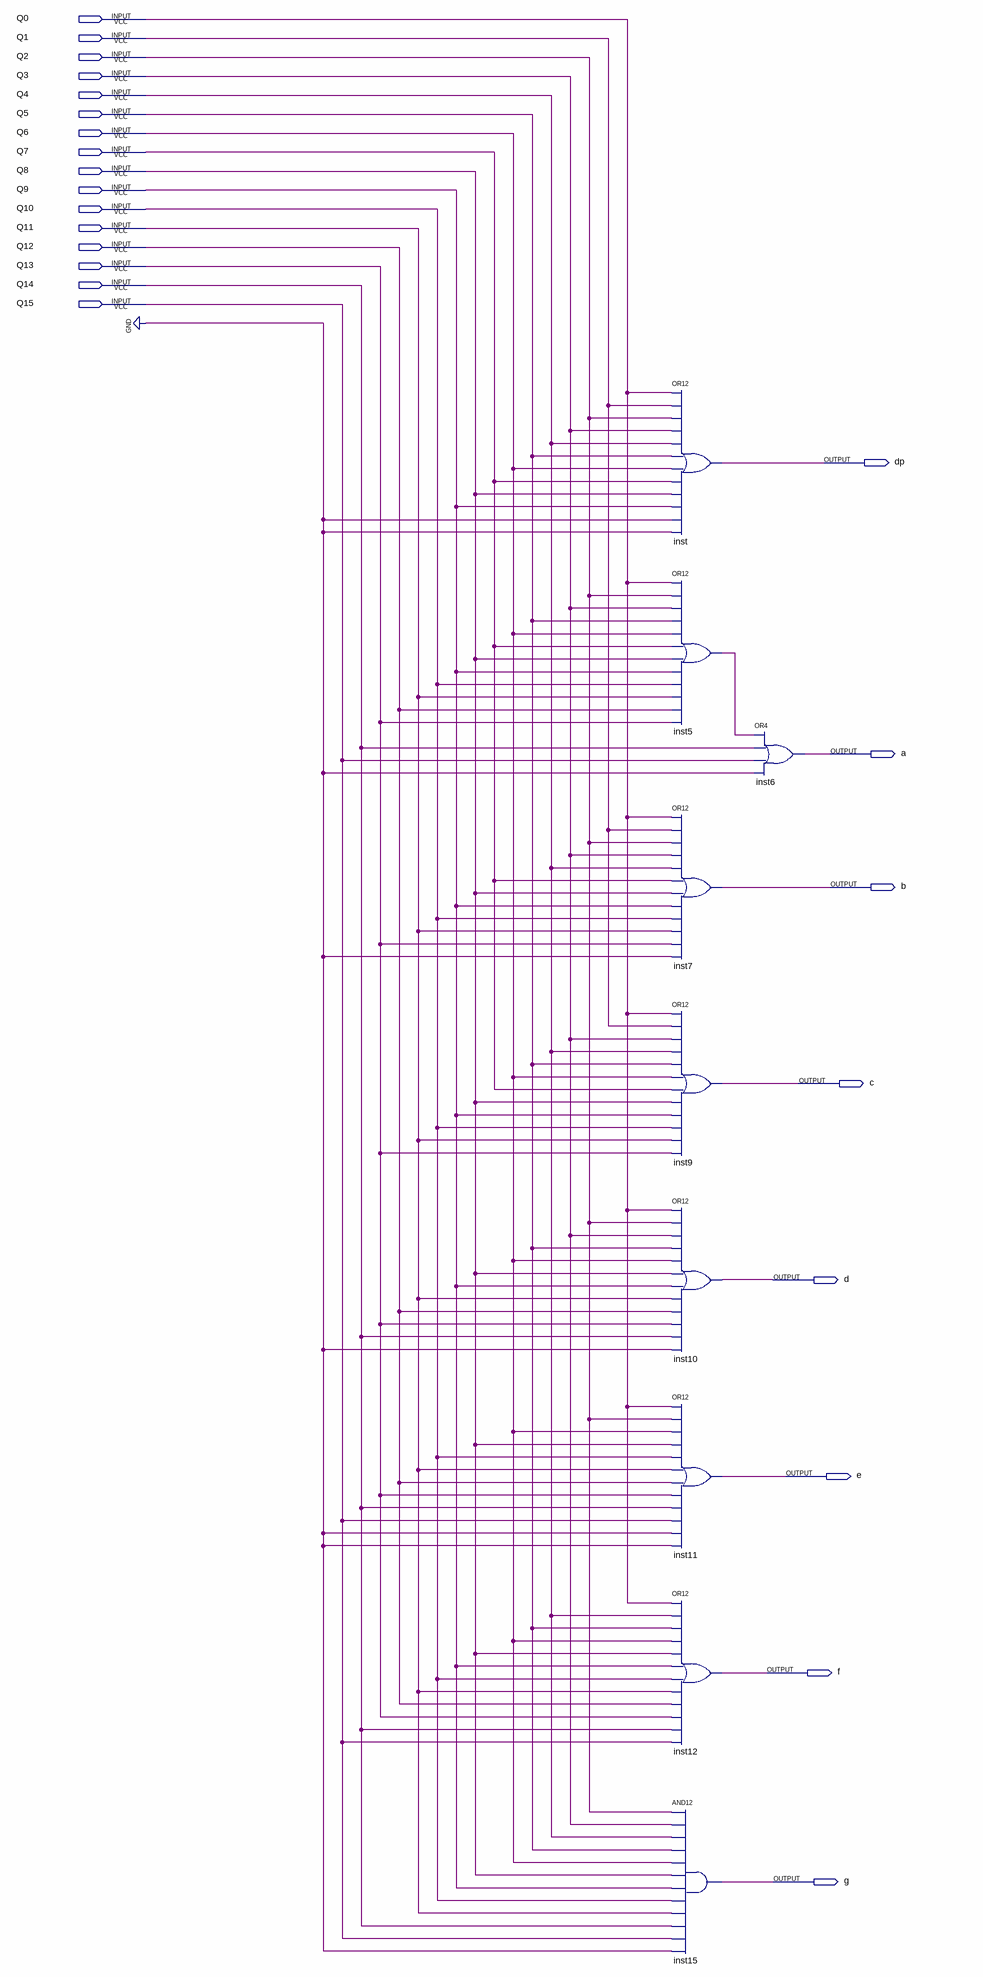
[diagram p0: schematic sheet]
// Quartus schematic digit16_to_7segm_Quartus.bdf as structural Verilog: 9 symbols, 24 pins
module digit16_to_7segm_Quartus (
  input  Q0,
  input  Q1,
  input  Q2,
  input  Q3,
  input  Q4,
  input  Q5,
  input  Q6,
  input  Q7,
  input  Q8,
  input  Q9,
  input  Q10,
  input  Q11,
  input  Q12,
  input  Q13,
  input  Q14,
  input  Q15,
  output dp,
  output a,
  output b,
  output c,
  output d,
  output e,
  output f,
  output g
);

  wire inst5_out;

  or inst (dp, Q0, Q1, Q2, Q3, Q4, Q5, Q6, Q7, Q8, Q9, 1'b0, 1'b0);
  or inst5 (inst5_out, Q0, Q2, Q3, Q5, Q6, Q7, Q8, Q9, Q10, Q11, Q12, Q13);
  or inst7 (b, Q0, Q1, Q2, Q3, Q4, Q7, Q8, Q9, Q10, Q11, Q13, 1'b0);
  or inst9 (c, Q0, Q1, Q3, Q4, Q5, Q6, Q7, Q8, Q9, Q10, Q11, Q13);
  or inst10 (d, Q0, Q2, Q3, Q5, Q6, Q8, Q9, Q11, Q12, Q13, Q14, 1'b0);
  or inst11 (e, Q0, Q2, Q6, Q8, Q10, Q11, Q12, Q13, Q14, Q15, 1'b0, 1'b0);
  or inst12 (f, Q0, Q4, Q5, Q6, Q8, Q9, Q10, Q11, Q12, Q13, Q14, Q15);
  and inst15 (g, Q2, Q3, Q4, Q5, Q6, Q8, Q9, Q10, Q11, Q14, Q15, 1'b0);
  or inst6 (a, inst5_out, Q14, Q15, 1'b0);
endmodule
